# Altium project Detector de Presencia ESP32.PrjPcb
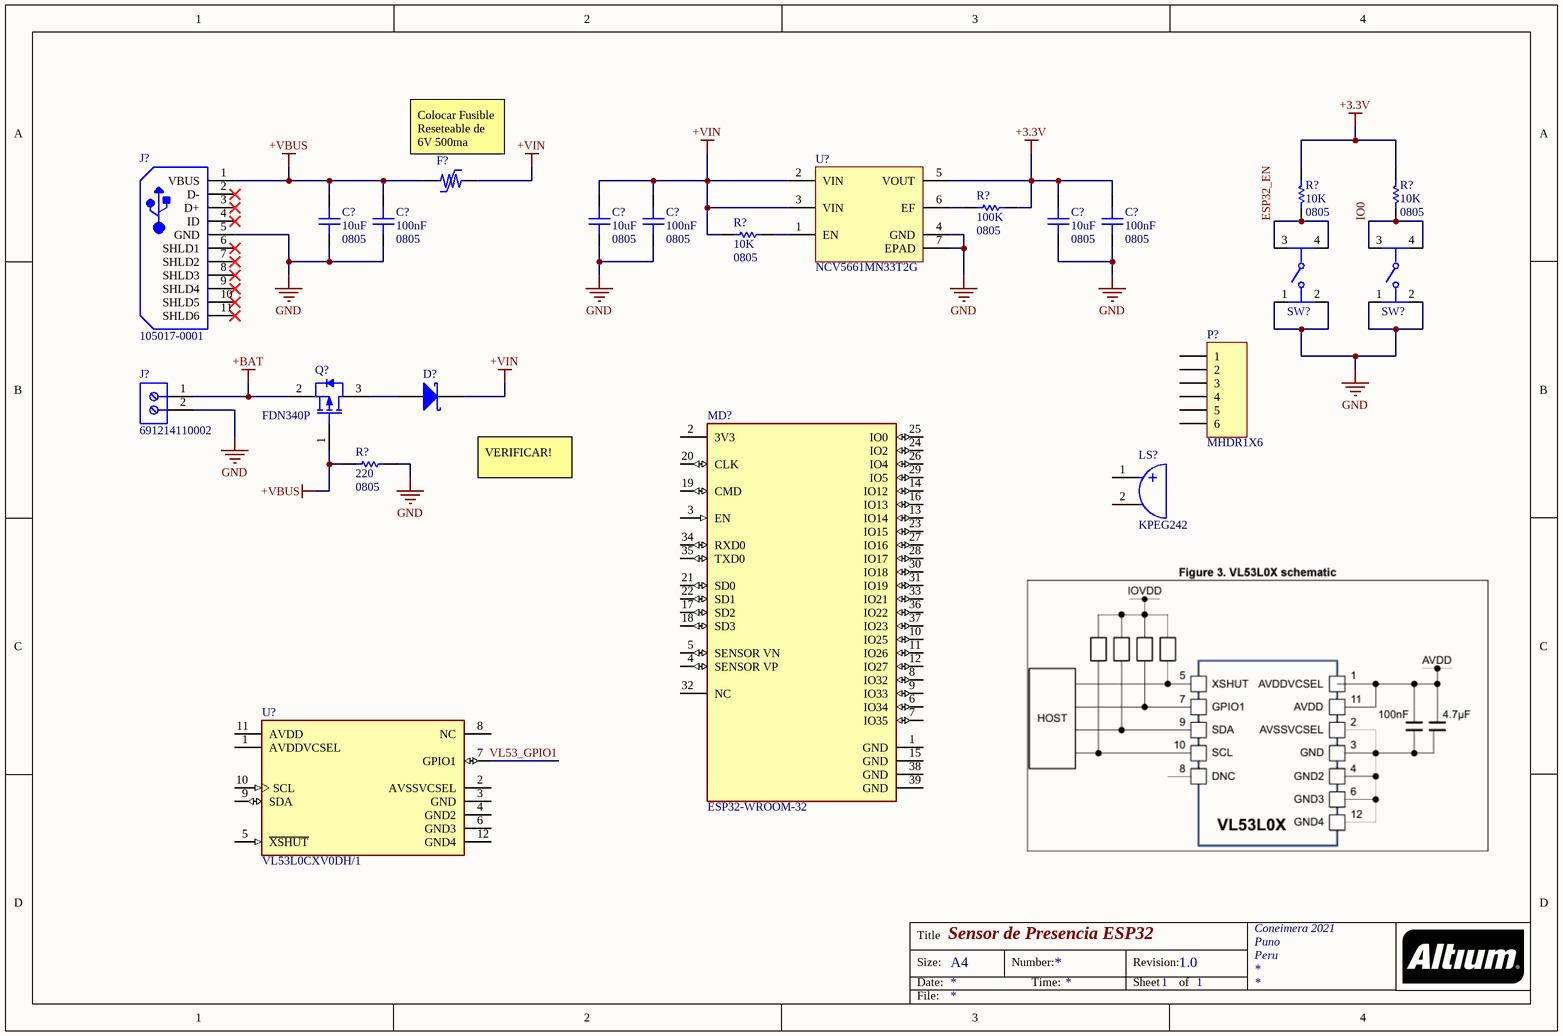
[diagram p0: Sheet1.SchDoc]
CAGE_CODE: ?????; CONTRACT_NUMBER: <CONTRACT NO>; DOC_NO_ASSY_DWG: <ASSY DWG NO>; DOC_NO_BOM: <BOM DOC NO>; DOC_NO_FAB_DWG: <FAB DWG NO>; DOC_NO_SCH_DWG: <SCH DWG NO>; PCB_2_DEC_TOL: +/-.01; PCB_3_DEC_TOL: +/-.010; PCB_ANG_TOL: +/-1/2; PCB_ASSEMBLY_NO: <PCB ASSY NO>; PCB_CHECKER: - -----; PCB_CHECKER_APP_DATE: --/--/----; PCB_DESIGNER: - -----; PCB_DESIGNER_APP_DATE: --/--/----; PCB_DWG_NO: <PCB DWG NO>; PCB_ENGINEER: - -----; PCB_ENGINEER_APP_DATE: --/--/----; PCB_PART_NUMBER: <PCB PN>; PCB_REV: A; SCH_REV: A
1 sheet, 23 parts. Net scope: global (net labels, ports and power ports of the same name join across sheets).
Board file: PCB1.PcbDoc

## Sheet Sheet1.SchDoc: Sensor de Presencia ESP32
size A4; Organization: Coneimera 2021; Address1: Puno; Address2: Peru; Revision: 1.0; SheetNumber: 1; SheetTotal: 1; ENG_APP_DATE: --/--/--; DSN_APP_DATE: --/--/--; CHK_APP_DATE: --/--/--

### Parts
(Parts that share a designator on the sheet are numbered #1, #2 ... from top to bottom, then left to right.)
C?#1  Capacitance: 10uF  Case/Package: 0805  [CAP0805B - TIPO2]  (hidden comment: Capacitor 0805)
C?#2  Capacitance: 100nF  Case/Package: 0805  [CAP0805B - TIPO2]  (hidden comment: Capacitor 0805)
C?#3  Capacitance: 10uF  Case/Package: 0805  [CAP0805B - TIPO2]  (hidden comment: Capacitor 0805)
C?#4  Capacitance: 100nF  Case/Package: 0805  [CAP0805B - TIPO2]  (hidden comment: Capacitor 0805)
C?#5  Capacitance: 10uF  Case/Package: 0805  [CAP0805B - TIPO2]  (hidden comment: Capacitor 0805)
C?#6  Capacitance: 100nF  Case/Package: 0805  [CAP0805B - TIPO2]  (hidden comment: Capacitor 0805)
D?  B5819W  [MCC-SOD123_V]  (value not drawn)
F?  MF-MSMF050-2  [BOUR-MF-MSMF050-2_V]  (value not drawn)
J?#1  105017-0001  [USB-MICRO-B_V]
J?#2  691214110002  [691214110002]
LS?  KPEG242  [KINGS-KPEG242-2]
MD?  ESP32-WROOM-32  [FP-ESP32-WROOM-32-MFG]
P?  MHDR1X6  [MHDR1X6]
Q?  FDN340P  [FAIR-SSOT3L-3_V]
R?#1  Resistance: 100K  Case/Package: 0805  [RES0805NL-A]  (hidden comment: CRCW08051M00FKEA)
R?#2  Resistance: 10K  Case/Package: 0805  [RES0805NL-A]  (hidden comment: CRCW08051M00FKEA)
R?#3  Resistance: 10K  Case/Package: 0805  [RES0805NL-A]  (hidden comment: CRCW08051M00FKEA)
R?#4  Resistance: 10K  Case/Package: 0805  [RES0805NL-A]  (hidden comment: CRCW08051M00FKEA)
R?#5  Resistance: 220  Case/Package: 0805  [RES0805NL-A]  (hidden comment: CRCW08051M00FKEA)
SW?#1  PTS810SJG250SMTRLFS  [FP-PTS810_SJG_250_SMTR_LF-MFG]  (value not drawn)
SW?#2  PTS810SJG250SMTRLFS  [FP-PTS810_SJG_250_SMTR_LF-MFG]  (value not drawn)
U?#1  NCV5661MN33T2G  [SON95P330X100_HS-7N]
U?#2  VL53L0CXV0DH/1  [FP-LGA-12-MFG]

### Nets
+3.3V: C?#5.2 C?#6.2 R?#1.1 R?#2.2 R?#3.2 U?#1.5(VOUT)
+BAT: J?#2.1 Q?.2(SOURCE)
+VBUS: C?#1.2 C?#2.2 F?.1 J?#1.1(VBUS) Q?.1(GATE) R?#5.1
+VIN: C?#3.2 C?#4.2 D?.2(K) F?.2 R?#4.2 U?#1.2(VIN) U?#1.3(VIN)
GND: C?#1.1 C?#2.1 C?#3.1 C?#4.1 C?#5.1 C?#6.1 J?#1.5(GND) J?#2.2 R?#5.2 SW?#1.1 SW?#1.2 SW?#2.1 SW?#2.2 U?#1.4(GND) U?#1.7(EPAD)
ESP32_EN: R?#2.1 SW?#1.3 SW?#1.4
IO0: R?#3.1 SW?#2.3 SW?#2.4
VL53_GPIO1: U?#2.7(GPIO1)
NetD?_1: D?.1(A) Q?.3(DRAIN)
NetR?#1_2: R?#1.2 U?#1.6(EF)
NetR?#4_1: R?#4.1 U?#1.1(EN)

Not connected (* = marked no-connect by the designer): J?#1 2(D-)* 3(D+)* 4(ID)* 6(SHLD1)* 7(SHLD2)* 8(SHLD3)* 9(SHLD4)* 10(SHLD5)* 11(SHLD6)*; LS? 1 2; MD? 1(GND) 2(3V3) 3(EN) 4(SENSOR_VP) 5(SENSOR_VN) 6(IO34) 7(IO35) 8(IO32) 9(IO33) 10(IO25) 11(IO26) 12(IO27) 13(IO14) 14(IO12) 15(GND) 16(IO13) 17(SD2) 18(SD3) 19(CMD) 20(CLK) 21(SD0) 22(SD1) 23(IO15) 24(IO2) 25(IO0) 26(IO4) 27(IO16) 28(IO17) 29(IO5) 30(IO18) 31(IO19) 32(NC) 33(IO21) 34(RXD0) 35(TXD0) 36(IO22) 37(IO23) 38(GND) 39(GND); P? 1 2 3 4 5 6; U?#2 1(AVDDVCSEL) 2(AVSSVCSEL) 3(GND) 4(GND2) 5(~{XSHUT}) 6(GND3) 8(NC) 9(SDA) 10(SCL) 11(AVDD) 12(GND4)

### Notes on the sheet
- (near F?) Colocar Fusible Reseteable de 6V 500ma
- VERIFICAR!
- Title
- Size:
- Date:
- A4
- Number:
- Time:
- Revision:
- Sheet
- of
- File:

### Library data of the parts
C?#1-C?#6 = Capacitor 0805: MURATA - GRM2195C1H103JA01D - SMD Multilayer Ceramic Capacitor, 10000 pF, 50 V, 0805 [2012 Metric], ± 5%, C0G / NP0, GRM Series; Voltage Rating: 50V; Temperature Coefficient: 30ppm/°C; Insulation Resistance: 10GR; Manufacturer: Murata; Manufacturer Part Number: GRM2195C1H103JA01D; RoHS: Yes; Category: Ceramic Capacitors; Mount: Surface Mount; Number of Pins: 2; Case Code (Metric): 2012; Case Code (Imperial): 0805; Dielectric Material: Ceramic; Material: Ceramic; Min Operating Temperature: -55°C; Max Operating Temperature: 125°C; Tolerance: 5%; Packaging: Tape and Reel; Voltage Rating (DC): 50V; Dielectric: C0G; Termination: SMD/SMT; Package Quantity: 1; Voltage: 50V; Length: 2mm; Height: 0.85mm; Width: 0.049inch; Thickness: 0.037inch; Depth: 1.25mm; Radiation Hardening: No; REACH SVHC: No SVHC; Lead Free: Lead Free
D? = CMP-004-00005-1: Schottky Barrier Rectifier, 40 V, 1 A, -65 to 125 degC, 2-Pin SOD123, RoHS, Tape and Reel; Manufacturer: Micro Commercial Components; Manufacturer URL: http://www.mccsemi.com/; Package Reference: SOD123; Package URL: http://www.mccsemi.com/up_pdf/1N4448W(SOD-123).pdf; Mounting Technology: SM; Datasheet URL: http://www.mccsemi.com/up_pdf/B5817W-B5819W(SOD-123).pdf; Package Description: 2-Pin Small Outline Diode, Body 2.7 x 1.6 mm, Height 1.35 mm; Case/Package: SOD123; Datasheet Version: Rev. B, 01/2013; RoHS Compliant: Unknown
F? = CMP-005-00001-2: PTC Resettable Fuse, 15 V, 500 mA, -40 to 85 degC, 2-Pin SMD, RoHS, Tape and Reel; Manufacturer: Bourns; Resistance: 150mohm; Current Rating: 100A; Voltage Rating: 15V; Datasheet URL: http://www.bourns.com/docs/Product-Datasheets/mfmsmf.pdf; Mounting Technology: SM; Lead Pitch: 4.73mm; Package Description: 2-Pin Surface Mount Device, Body 4.55 x 3.24 mm; Packaging: TapeandReel; Package Quantity: 2000; Min Operating Temperature: -40°C; Case/Package: 1812; Package Reference: MF-MSMF050-2; Max Operating Temperature: 85°C; Datasheet Version: Rev. AG, 08/2016; RoHS Compliant: True; Nominal Supply Voltage: 15V
J?#1 = CMP-2000-05827-1: Micro-USB B Receptacle, Right Angle, Bottom Mount, Surface Mount, with Solder Tabs, -30 to 85 degC, 5-Pin USB, RoHS, Tape and Reel; Manufacturer: Molex; Featured Product: Micro-USBConnectorsUSBConnectors; Other Names: WM1399DKR; Package Version: Rev. F, 12/2012; Number of Contacts: 5; Connector Type: USB-microB; Catalog Drawings: 1050170001; 3D Model: 105017-0001.stp; Mating Products: WM17145-ND-CABLEMICROUSBBTOSTDA1.0MWM17147-ND-CABLEMICROUSBBTOSTDA2.0MWM17146-ND-CABLEMICROUSBBTOSTDA1.5M; PCN Assembly/Origin: ResinSupplier21/Oct/2015; Voltage - Max: 30V; Online Catalog: Molex-MicroUSB; Manufacturer URL: http://www.molex.com/; Package Description: 5-Leads USB, Micro B, Body 7.5 x 5 mm, Pitch 0.65 mm; Datasheet URL: http://www.molex.com/elqNow/elqRedir.htm?ref=http://www.molex.com/webdocs/datasheets/pdf/en-us/1050170001_IO_CONNECTORS.pdf; Ingress Protection: -; Datasheet Version: 03/2016; Mounting Type: BoardCutout,SurfaceMount,RightAngle; Circuits: 5; Standard Package: 1; Package Reference: MICRO-B; Package URL: http://www.molex.com/pdm_docs/sd/1050170001_sd.pdf; Category: Connectors,Interconnects; Series: -; RoHS Information: 1050170001CertofCompliance; Features: Shielded,SolderRetention; Family: USB,DVI,HDMIConnectors; Specifications: -; Gender: Receptacle; Packaging: Digi-Reel®; Mounting Technology: SurfaceMount
J?#2 = CMP-1502-02464-1: Serie 2141 - 3.50 mm Horizontal Entry Modular with Rising Cage Clamp WR-TBL, 2 pin; Manufacturer: Wurth Elektronik; Pin Number: 2; Pitch: 3.50mm; Datasheet URL: http://katalog.we-online.de/em/datasheet/6912141100xx.pdf; Packaging: Box; Mounting Technology: THT; Package Reference: 691214110002; Manufacturer URL: http://www.we-online.de; Part Number: 691214110002; Publisher: WurthElektronik; Operating Temperature: -40to105degC
LS? = CMP-2000-06518-1: Piezo Indicator, 4100 Hz, 3 to 16 V, -20 to 70 degC, 2-Pin THD, RoHS; PartNumber: KPE-242; Manufacturer: KingstateElectronicsCorp.; Frequency Range: 3600to4600Hz; Maximum Supply Current: 7mA; Typical Operating Supply Voltage: 12Vdc; Product Height: 7.6mm; Current - Max: 7A; Tone Mode: Continuous; Product Diameter: 13.7mm; Minimum Sound Pressure: 70dBA; Maximum Resonant Frequency: 4600Hz; Type: Indicator; Datasheet URL: https://datasheet.ciiva.com/11776/0900766b8068f3a2-11776713.pdf; Mounting: ThroughHole; Technology: Piezo; Operating Temperature: -20to70°C; Category: AudioIndicatorsandAlerts; Termination Method: Pin; Manufacturer URL: http://www.kingstate.com.tw/index.php/en/; Package Description: 2-Pin Through Hole Device, Body Dia 13.7 mm, Pitch 7.62 mm; Datasheet Version: 01/2006; Package Reference: KPEG242; Mounting Technology: ThroughHole
MD? = CMP-194065-000008-1: RX TXRX MOD WIFI SURFACE MOUNT; Frequency: 2.5GHz; Sensitivity: -98dBm; Operating Supply Voltage: 3.6V; Data Rate: 150Mbps; Weight: 0.088185oz; Package Quantity: 550; Min Operating Temperature: -40°C; Mount: Surface Mount; Max Operating Temperature: 85°C; Packaging: Cut Tape; Case/Package: SMD/SMT
P? = MHDR1X6: Header, 6-Pin; LatestRevisionDate: 17-Jul-2002; LatestRevisionNote: Re-released for DXP Platform.; Publisher: Altium Limited
Q? = CMP-013-00016-2: Single P-Channel, Logic Level, PowerTrench(R) MOSFET, 2 A, 20 V, -55 to 150 degC, 3-Pin SOT-23, RoHS, Tape and Reel; Manufacturer: Fairchild Semiconductor; Typical Rise Time: 9ns; Nominal Dual Supply Voltage: -20V; Elements: 1; Power: 500mW; Nominal Vgs: -800mV; Rds On Max: 70mohm; Input Capacitance: 779pF; Package Version: Rev. 3, 05/2015; Mounting Technology: SM; RoHS Compliant: True; Package Reference: SSOT3L; Min Operating Temperature: -55°C; Package Description: 3-Pin Small Outline Transistor, Body 2.92 x 1.4 mm, Pitch 0.95 mm; Packaging: TapeandReel; Case/Package: TO-236-3; Datasheet URL: https://www.fairchildsemi.com/datasheets/FD/FDN340P.pdf; Pins: 3; Max Operating Temperature: 150°C; Package Quantity: 3000; Datasheet Version: Rev. E1, 02/2007
R?#1-R?#5 = CRCW08051M00FKEA: RES SMD 1M OHM 1% 1/8W 0805; Manufacturer: Vishay; Manufacturer Part Number: CRCW0805-1M00FKEA; Power Rating: 125mW; Voltage Rating: 150V; Temperature Coefficient: 100ppm/°C; RoHS: Yes; Category: Chip SMD Resistors; Mount: Surface Mount; Number of Pins: 2; Case Code (Imperial): 0805; Case Code (Metric): 2012; Contact Plating: Tin; Weight: 0.000194oz; Min Operating Temperature: -55°C; Max Operating Temperature: 155°C; Tolerance: 1%; Packaging: Tape and Reel; Resistor Type: Thick Film; Termination: SMD/SMT; Package Quantity: 5000; Voltage Rating (DC): 150V; Length: 2mm; Width: 1.25mm; Height: 0.45mm; Depth: 1.25mm; Radiation Hardening: No; REACH SVHC: Unknown; Military Standard: Not; Lead Free: Lead Free; ComponentLink1URL: https://datasheet.ciiva.com/11810/0900766b80d98b26-11810665.pdf?src-supplier=RSComponents; ComponentLink1Description: https://datasheet.ciiva.com/11810/0900766b80d98b26-11810665.pdf?src-supplier=RSComponents; ComponentLink2URL: https://datasheet.ciiva.com/7841/1720486-7841845.pdf?src-supplier=Element14; ComponentLink2Description: https://datasheet.ciiva.com/7841/1720486-7841845.pdf?src-supplier=Element14; ComponentLink3URL: https://datasheet.ciiva.com/16514/dcrcwe3-16514634.pdf?src-supplier=Avnet+Asia; ComponentLink3Description: https://datasheet.ciiva.com/16514/dcrcwe3-16514634.pdf?src-supplier=Avnet+Asia; ComponentLink4URL: https://datasheet.ciiva.com/16721/70201119-16721483.pdf?src-supplier=Allied+Electronics; ComponentLink4Description: https://datasheet.ciiva.com/16721/70201119-16721483.pdf?src-supplier=Allied+Electronics; ComponentLink5URL: https://datasheet.ciiva.com/7841/1697337-7841645.pdf?src-supplier=Element14; ComponentLink5Description: https://datasheet.ciiva.com/7841/1697337-7841645.pdf?src-supplier=Element14; ComponentLink6URL: https://datasheet.ciiva.com/16380/dcrcwe3-16380086.pdf?src-supplier=Future+Electronics; ComponentLink6Description: https://datasheet.ciiva.com/16380/dcrcwe3-16380086.pdf?src-supplier=Future+Electronics
SW?#1 SW?#2 = CMP-011-00013-3: Switch Tactile N.O. SPST Button J-Bend 0.05A 16VDC 100000Cycles 3.92N SMD T/R; Illumination Type: Non-Illuminated; Actuator Type: Standard; Switch Function: Off-Mom; Voltage Rating (DC): 16V; Operating Force: 400gf; Current Rating: 50mA; Switch Travel: 0.2mm; Packaging: Tape and Reel; Mount: Surface Mount; Orientation: Straight; Min Operating Temperature: -40°C; Length: 3.2mm; Color: Blue; Lead Free: Lead Free; Case/Package: SMD/SMT; Termination: J-Bend; Throw Configuration: SPST; Contact Plating: Silver; Mechanical Life: 100000Cycles; Max Current Rating: 50mA; Depth: 4.6mm; Package Quantity: 2900; Max Operating Temperature: 85°C
U?#1 = NCV5661MN33T2G: LDO Regulator Pos 3.3V 1A Automotive 6-Pin DFN EP T/R; Manufacturer: ON Semiconductor; Dropout Voltage: 1V; Max Input Voltage: 9V; Min Input Voltage: 2V; Number of Outputs: 1; Reference Voltage: 900mV; Polarity: Positive; Quiescent Current: 3mA; Accuracy: 1%; Output Type: Fixed; Manufacturer Part Number: NCV5661MN33T2G; RoHS: Yes; Category: Voltage Regulators - Linear; Stock 1: 95; Pricing 1: 1=1.01000, 10=0.90100, 25=0.85520, 100=0.70240, 250=0.65656, 500=0.58024, 1000=0.50418 (USD); Mount: Surface Mount; Case/Package: DFN; Number of Pins: 6; Min Operating Temperature: -40°C; Max Operating Temperature: 150°C; Package Quantity: 3000; Output Voltage: 3.3V; Output Current: 1A; Packaging: Tape and Reel; Max Output Current: 1A; Number of Regulators: 1; Output Voltage Accuracy: 1%; Series: Automotive, AEC-Q100; Length: 3.3mm; Width: 3mm; Height: 0.85mm; Radiation Hardening: No; Lead Free: Lead Free; Halogen Free: Halogen Free; RoHS Compliant: Yes; ComponentLink1URL: https://datasheet.ciiva.com/2062/ncp5661-d-2062579.pdf?src-supplier=Digi-Key; ComponentLink1Description: https://datasheet.ciiva.com/2062/ncp5661-d-2062579.pdf?src-supplier=Digi-Key; Supplier 1: Mouser; Supplier Part Number 1: 863-NCV5661MN33T2G
U?#2 = CMP-2000-07484-2: SENSOR OPTICAL 200CM I2C; Manufacturer: STMicroelectronics; Operating Supply Current: 0.016-19mA; Max Supply Voltage: 3.5V; Min Supply Voltage: 1.6V; Description: Optical Sensor 200cm I²C Output; Height: 1.05mm; Package: LGA-12; Digikey Description: SENSOR OPTICAL 200CM I2C; Device Class L1: Sensors; Device Class L2: Optical Sensors; Temperature Range High: +70°C; Sensor Output: I2C; ComponentLink2URL: https://www.st.com/resource/en/datasheet/vl53l0x.pdf; RoHS: TRUE; Temperature: -20°C to +70°C; Device Class L3: unset; Lead Free: Yes; Temperature Range Low: -20°C; Category: IC; Manufacturer Part Number: VL53L0CXV0DH/1; ComponentLink2Description: Datasheet; Octopart: https://octopart.com/vl53l0cxv0dh%2F1-stmicroelectronics-71168165; Automotive: No